# Altium schematic sheet CH32M030G8R7-R0.SchDoc
size A4; SheetNumber: 1; SheetTotal: 1
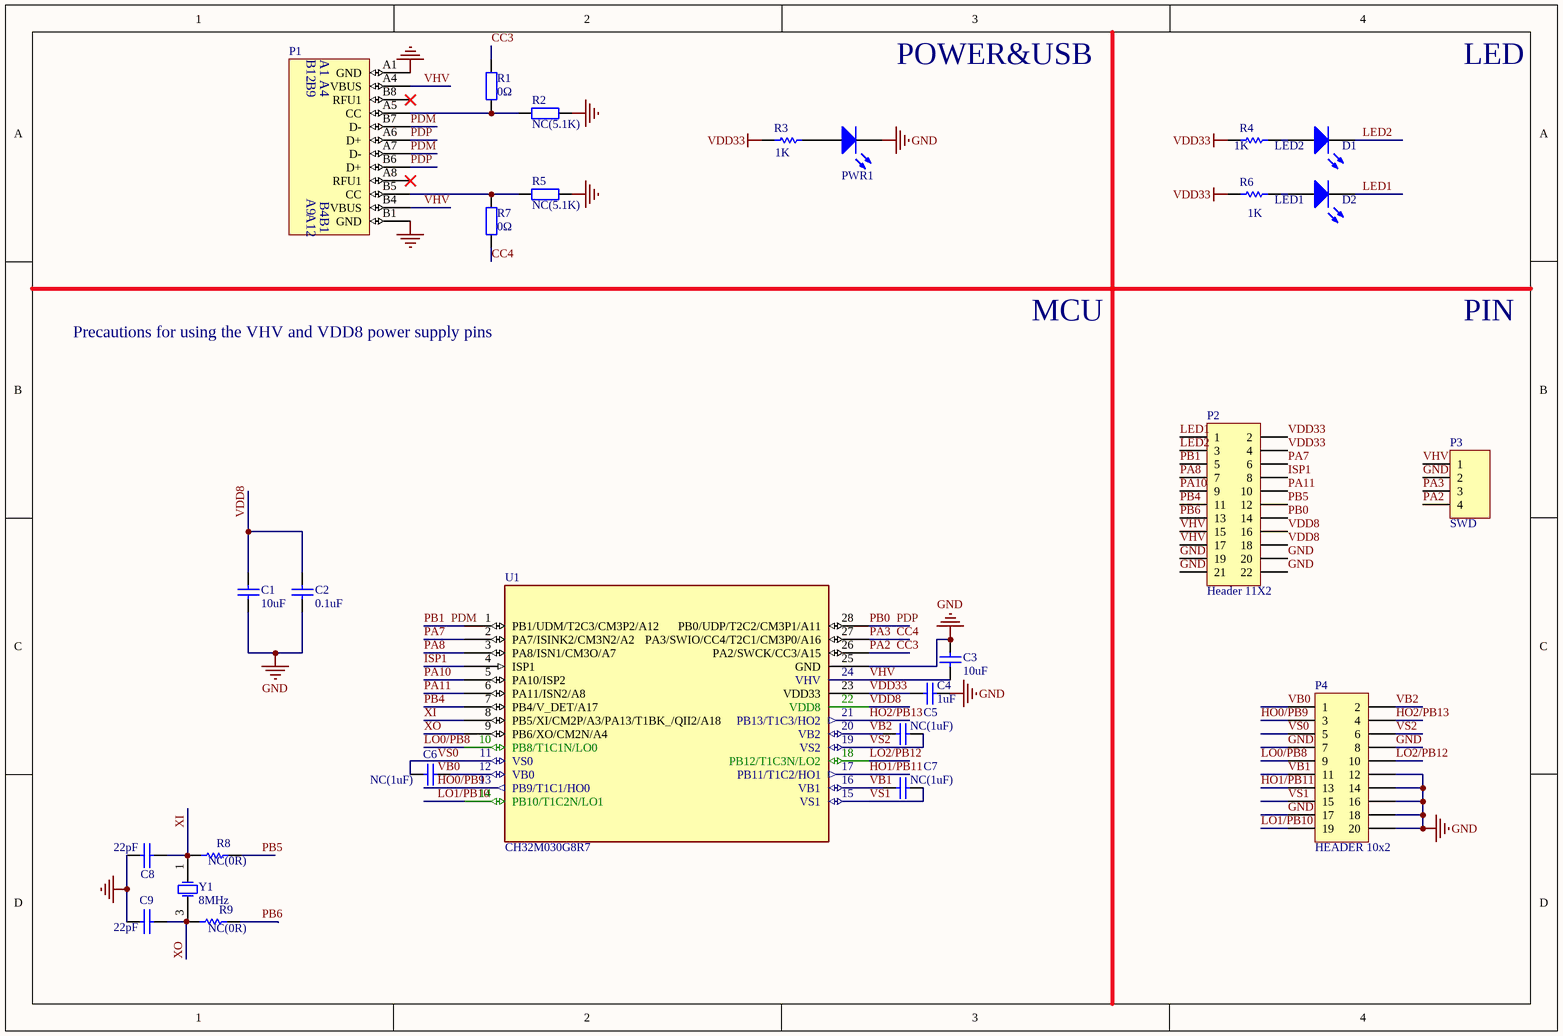
[diagram p0: CH32M030G8R7-R0.SchDoc]

## Parts
C1  10uF  [0603_C]
C2  0.1uF  [0603_C]
C3  10uF  [0603_C]
C4  1uF  [0603_C]
C5  NC(1uF)  [0603_C]
C6  NC(1uF)  [0603_C]
C7  NC(1uF)  [0603_C]
C8  22pF  [0603_C]
C9  22pF  [0603_C]
D1  LED2  [0603+]
D2  LED1  [0603+]
P1  TYPE-C  [TYPE-C-Receptacle-2.0]  (value not drawn)
P2  Header 11X2  [IDC22-2.54mm]
P3  SWD  [SIP4-2.54mm]
P4  HEADER 10x2  [IDC20-2.54MM]
PWR1  POWER  red  [0603+]  (value not drawn)
R1  0Ω  [0603]
R2  NC(5.1K)  [0603]
R3  1K  [0603]
R4  1K  [0603]
R5  NC(5.1K)  [0603]
R6  1K  [0603]
R7  0Ω  [0603]
R8  NC(0R)  [0603]
R9  NC(0R)  [0603]
U1  CH32M030G8R7  [QSOP28]
Y1  8MHz  [XT3225]

## Nets
GND: C1.1 C2.1 C3.1 C4.1 C8.1 C9.1 P1.A1(GND) P1.B1(GND) P2.19 P2.20 P2.21 P2.22 P3.2 P4.7 P4.8 P4.12 P4.14 P4.16 P4.17 P4.18 P4.20 PWR1.2(K) R2.2 R5.2 U1.25(GND)
VDD33: C4.2 P2.2 P2.4 R3.2 R4.1 R6.1 U1.23(VDD33)
CC3: P3.4 R1.2 U1.26(PA2/SWCK/CC3/A15)  [also labelled PA2]
CC4: P3.3 R7.1 U1.27(PA3/SWIO/CC4/T2C1/CM3P0/A16)  [also labelled PA3]
HO0/PB9: P4.3 U1.13(PB9/T1C1/HO0)
HO1/PB11: P4.13 U1.17(PB11/T1C2/HO1)
HO2/PB13: P4.4 U1.21(PB13/T1C3/HO2)
ISP1: P2.8 U1.4(ISP1)
LED1: D2.2(K) P2.1
LED2: D1.2(K) P2.3
LO0/PB8: P4.9 U1.10(PB8/T1C1N/LO0)
LO1/PB10: P4.19 U1.14(PB10/T1C2N/LO1)
LO2/PB12: P4.10 U1.18(PB12/T1C3N/LO2)
PA7: P2.6 U1.2(PA7/ISINK2/CM3N2/A2)
PA8: P2.7 U1.3(PA8/ISN1/CM3O/A7)
PA10: P2.9 U1.5(PA10/ISP2)
PA11: P2.10 U1.6(PA11/ISN2/A8)
PB0: P1.A6(D+) P1.B6(D+) P2.14 U1.28(PB0/UDP/T2C2/CM3P1/A11)  [also labelled PDP]
PB1: P1.A7(D-) P1.B7(D-) P2.5 U1.1(PB1/UDM/T2C3/CM3P2/A12)  [also labelled PDM]
PB4: P2.11 U1.7(PB4/V_DET/A17)
PB5: P2.12 R8.2
PB6: P2.13 R9.2
VB0: P4.1
VB1: C7.2 P4.11 U1.16(VB1)
VB2: C5.2 P4.2 U1.20(VB2)
VDD8: C1.2 C2.2 P2.16 P2.18 U1.22(VDD8)
VHV: C3.2 P1.A4(VBUS) P1.B4(VBUS) P2.15 P2.17 P3.1 U1.24(VHV)
VS0: C6.1 P4.5 U1.11(VS0)
VS1: C7.1 P4.15 U1.15(VS1)
VS2: C5.1 P4.6 U1.19(VS2)
XI: C8.2 R8.1 U1.8(PB5/XI/CM2P/A3/PA13/T1BK_/QII2/A18) Y1.1(OSC1)
XO: C9.2 R9.1 U1.9(PB6/XO/CM2N/A4)
NetC6_2: C6.2 U1.12(VB0)
NetD1_1: D1.1(A) R4.2
NetD2_1: D2.1(A) R6.2
NetP1_A5: P1.A5(CC) R1.1 R2.1
NetP1_B5: P1.B5(CC) R5.1 R7.2
NetPWR1_1: PWR1.1(A) R3.1

Not connected (* = marked no-connect by the designer): P1 A8(RFU1)* B8(RFU1)*; Y1 3(OSC2)

## Notes on the sheet
- POWER&USB
- LED
- Precautions for using the VHV and VDD8 power supply pins
- MCU
- PIN
- Labels drawn without touching a wire or pin: VB0
- (in symbol TYPE-C1) B12; B9; A9; A12

## Library data of the parts
C1-C7 = Cap: Capacitor; Published: 8-Jun-2000; LatestRevisionDate: 17-Jul-2002; LatestRevisionNote: Re-released for DXP Platform.; PackageReference: RAD-0.3; Publisher: Altium Limited
C8 C9 = CAP: Capacitor
D1 D2 PWR1 = LED0: Typical INFRARED GaAs LED; Published: 8-Jun-2000; LatestRevisionDate: 08-Jul-2005; LatestRevisionNote: Mech Layer 1 removed.; PackageReference: LED-0; Publisher: Altium Limited
P1 = TYPE-C1
P2 = Header 11X2: Header, 11-Pin, Dual row; LatestRevisionDate: 17-Jul-2002; LatestRevisionNote: Re-released for DXP Platform.; Publisher: Altium Limited
P3 = HEADER 4: Header, 4-Pin
P4 = HEADER 10x2: Header, 10-Pin, Dual row
R1 R2 R5 R7 = Res2: Resistor
R3 R4 R6 R8 R9 = Res Semi: Semiconductor Resistor; Published: 8-Jun-2000; LatestRevisionDate: 17-Jul-2002; LatestRevisionNote: Re-released for DXP Platform.; PackageReference: AXIAL-0.5; Publisher: Altium Limited
U1 = CH32M030G8R7: RISC-V MCU, 72MHz, USB, Type-C/PD, OPA, CMP, 28V gate driver
Y1 = XTAL: Crystal Oscillator; Published: 8-Jun-2000; LatestRevisionDate: 17-Jul-2002; LatestRevisionNote: Re-released for DXP Platform.; PackageReference: R38; Publisher: Altium Limited; PackageDescription: Crystal, Thru-Hole; 2 Leads; Body 3.1 x 8.2 mm (Dia.xH)